# Altium schematic sheet Main.SchDoc
size A4
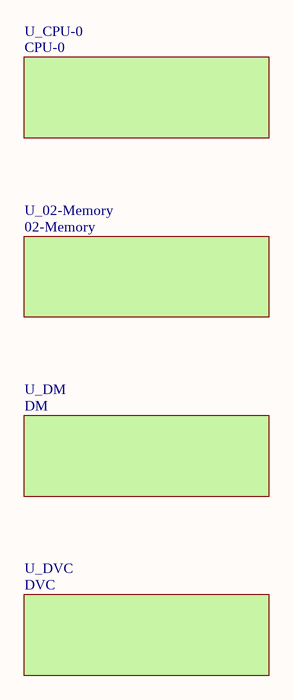
[diagram p0: Main.SchDoc]

## Sub-sheets
U_02-Memory = 02-Memory: no entries
U_CPU-0 = CPU-0: no entries
U_DM = DM: no entries
U_DVC = DVC: no entries